# Altium schematic sheet 8_sata.SchDoc
size A4
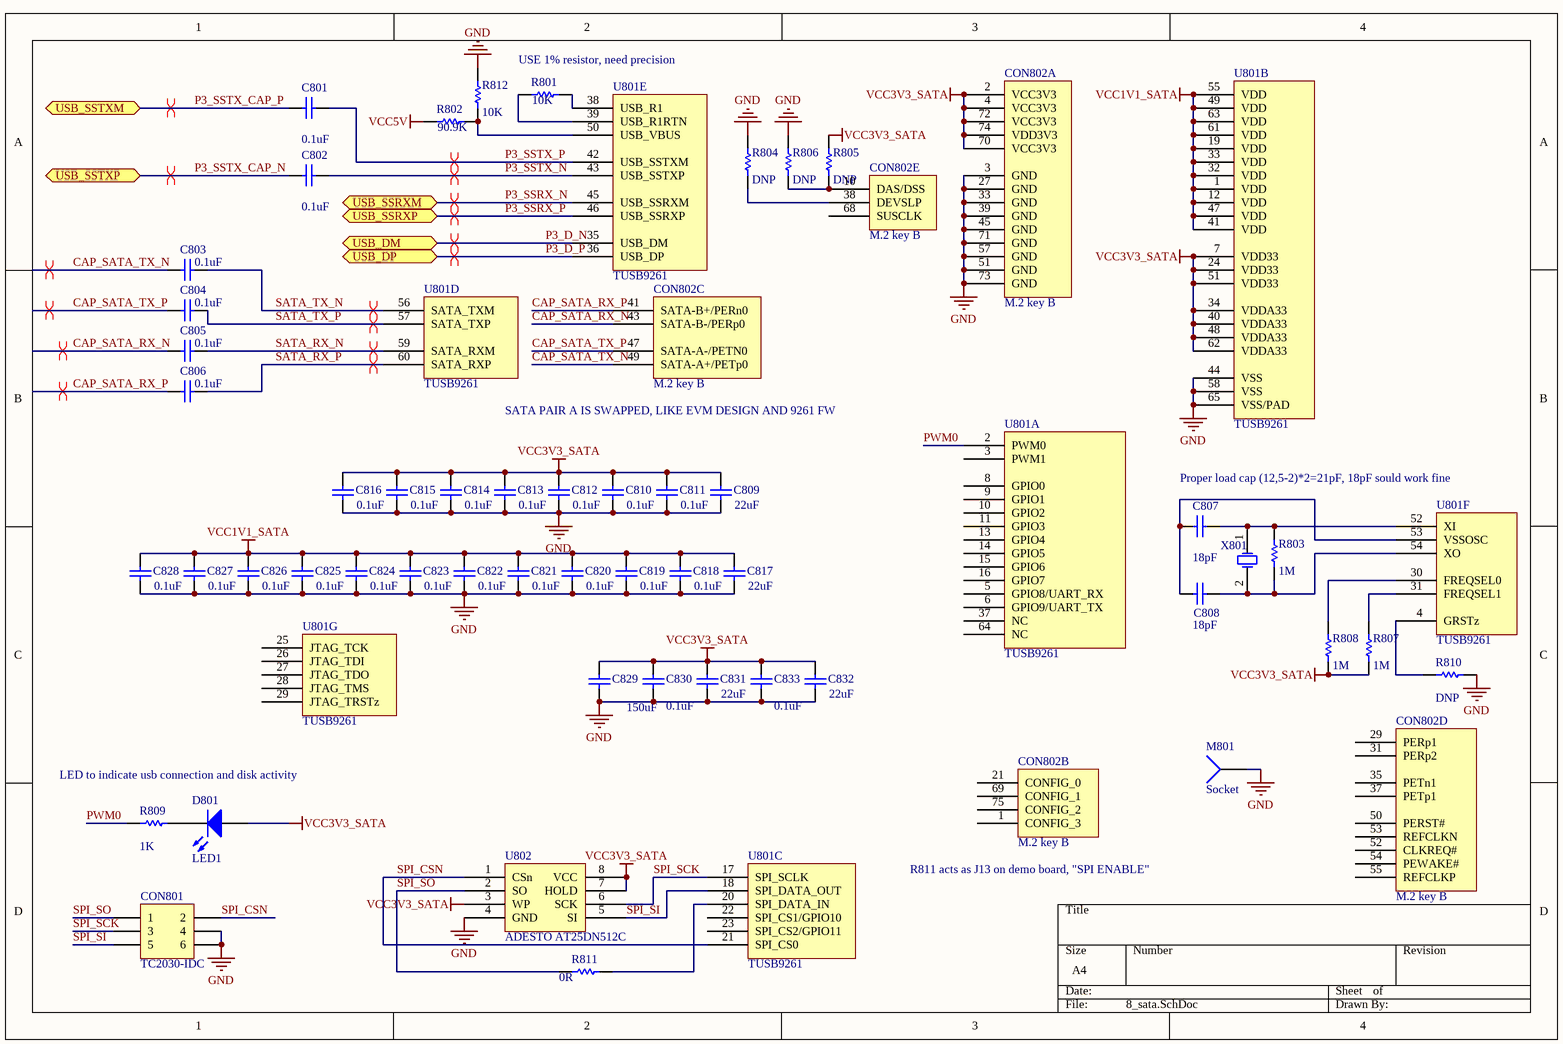
[diagram p0: 8_sata.SchDoc]

## Parts
C801  value 0.1uF  [C0402[1005]]
C802  value 0.1uF  [C0402[1005]]
C803  value 0.1uF  [C0402[1005]]
C804  value 0.1uF  [C0402[1005]]
C805  value 0.1uF  [C0402[1005]]
C806  value 0.1uF  [C0402[1005]]
C807  value 18pF  [C0603[1608]]
C808  value 18pF  [C0603[1608]]
C809  value 22uF  [C1206[3216]]
C810  value 0.1uF  [C0603[1608]]
C811  value 0.1uF  [C0603[1608]]
C812  value 0.1uF  [C0603[1608]]
C813  value 0.1uF  [C0603[1608]]
C814  value 0.1uF  [C0603[1608]]
C815  value 0.1uF  [C0603[1608]]
C816  value 0.1uF  [C0603[1608]]
C817  value 22uF  [C1206[3216]]
C818  value 0.1uF  [C0603[1608]]
C819  value 0.1uF  [C0603[1608]]
C820  value 0.1uF  [C0603[1608]]
C821  value 0.1uF  [C0603[1608]]
C822  value 0.1uF  [C0603[1608]]
C823  value 0.1uF  [C0603[1608]]
C824  value 0.1uF  [C0603[1608]]
C825  value 0.1uF  [C0603[1608]]
C826  value 0.1uF  [C0603[1608]]
C827  value 0.1uF  [C0603[1608]]
C828  value 0.1uF  [C0603[1608]]
C829  value 150uF  [C_9G_9H]
C830  value 0.1uF  [C0603[1608]]
C831  value 22uF  [C1206[3216]]
C832  value 22uF  [C1206[3216]]
C833  value 0.1uF  [C0603[1608]]
CON801  TC2030-IDC  [TC2030-IDC-NL]  (no BOM)
CON802  M.2 key B  [Amphenol 10128796]  (parts A,B,C,D,E of 5)
D801  LED1  [LED0603[1608]]
M801  Socket  [Wurth  9774060243R]
R801  value 10K  [R0603[1608]]
R802  value 90.9K  [R0603[1608]]
R803  value 1M  [R0603[1608]]
R804  value DNP  [R0603[1608]]
R805  value DNP  [R0603[1608]]
R806  value DNP  [R0603[1608]]
R807  value 1M  [R0603[1608]]
R808  value 1M  [R0603[1608]]
R809  value 1K  [R0603[1608]]
R810  value DNP  [R0603[1608]]
R811  value 0R  [R0603[1608]]
R812  value 10K  [R0603[1608]]
U801  TUSB9261  [TUSB9261]  (parts A,B,C,D,E,F,G of 7)
U802  ADESTO AT25DN512C  [ADESTO AT25DN512C -TSOP]
X801  (no value)  [CTS 445-series crystal]

## Ports
USB_DM, USB_DP, USB_SSRXM, USB_SSRXP, USB_SSTXM, USB_SSTXP

## Nets
GND: C809.1 C810.1 C811.1 C812.1 C813.1 C814.1 C815.1 C816.1 C817.1 C818.1 C819.1 C820.1 C821.1 C822.1 C823.1 C824.1 C825.1 C826.1 C827.1 C828.1 C829.1 C830.1 C831.1 C832.1 C833.1 CON801.4 CON801.6 CON802.3(GND) CON802.27(GND) CON802.33(GND) CON802.39(GND) CON802.45(GND) CON802.51(GND) CON802.57(GND) CON802.71(GND) CON802.73(GND) M801.1 R804.1 R806.1 R810.2 R812.1 U801.44(VSS) U801.58(VSS) U801.65(VSS/PAD) U802.4(GND)
VCC1V1_SATA: C817.2 C818.2 C819.2 C820.2 C821.2 C822.2 C823.2 C824.2 C825.2 C826.2 C827.2 C828.2 U801.1(VDD) U801.12(VDD) U801.19(VDD) U801.32(VDD) U801.33(VDD) U801.41(VDD) U801.47(VDD) U801.49(VDD) U801.55(VDD) U801.61(VDD) U801.63(VDD)
VCC3V3_SATA: C809.2 C810.2 C811.2 C812.2 C813.2 C814.2 C815.2 C816.2 C829.2 C830.2 C831.2 C832.2 C833.2 CON802.2(VCC3V3) CON802.4(VCC3V3) CON802.70(VCC3V3) CON802.72(VCC3V3) CON802.74(VDD3V3) D801.2(A) R805.1 R807.2 R808.2 U801.7(VDD33) U801.24(VDD33) U801.34(VDDA33) U801.40(VDDA33) U801.48(VDDA33) U801.51(VDD33) U801.62(VDDA33) U802.3(WP) U802.7(HOLD) U802.8(VCC)
VCC5V: R802.1
CAP_SATA_RX_N: C805.2 CON802.43(SATA-B-/PERp0)
CAP_SATA_RX_P: C806.2 CON802.41(SATA-B+/PERn0)
CAP_SATA_TX_N: C803.2 CON802.49(SATA-A+/PETp0)
CAP_SATA_TX_P: C804.2 CON802.47(SATA-A-/PETN0)
P3_D_N: U801.35(USB_DM) ; port USB_DM
P3_D_P: U801.36(USB_DP) ; port USB_DP
P3_SSRX_N: U801.45(USB_SSRXM) ; port USB_SSRXM
P3_SSRX_P: U801.46(USB_SSRXP) ; port USB_SSRXP
P3_SSTX_CAP_N: C802.2 ; port USB_SSTXP
P3_SSTX_CAP_P: C801.2 ; port USB_SSTXM
P3_SSTX_N: C802.1 U801.43(USB_SSTXP)
P3_SSTX_P: C801.1 U801.42(USB_SSTXM)
PWM0: R809.1 U801.2(PWM0)
SATA_RX_N: C805.1 U801.59(SATA_RXM)
SATA_RX_P: C806.1 U801.60(SATA_RXP)
SATA_TX_N: C803.1 U801.56(SATA_TXM)
SATA_TX_P: C804.1 U801.57(SATA_TXP)
SPI_CSN: CON801.2 U801.21(SPI_CS0) U802.1(CSn)
SPI_SCK: CON801.3 U801.17(SPI_SCLK) U802.6(SCK)
SPI_SI: CON801.5 U801.18(SPI_DATA_OUT) U802.5(SI)
SPI_SO: CON801.1 R811.2 U802.2(SO)
NetC807_1: C807.1 C808.1 U801.53(VSSOSC)
NetC807_2: C807.2 R803.1 U801.52(XI) X801.1(OSC1)
NetC808_2: C808.2 R803.2 U801.54(XO) X801.2(OSC2)
NetCON802_10: CON802.10(DAS/DSS) R805.2 R806.2
NetCON802_38: CON802.38(DEVSLP) R804.2
NetD801_1: D801.1(K) R809.2
NetR801_1: R801.1 U801.39(USB_R1RTN)
NetR801_2: R801.2 U801.38(USB_R1)
NetR802_2: R802.2 R812.2 U801.50(USB_VBUS)
NetR807_1: R807.1 U801.31(FREQSEL1)
NetR808_1: R808.1 U801.30(FREQSEL0)
NetR810_1: R810.1 U801.4(GRSTz)
NetR811_1: R811.1 U801.20(SPI_DATA_IN)

Not connected (* = marked no-connect by the designer): CON802 1(CONFIG_3) 21(CONFIG_0) 29(PERp1) 31(PERp2) 35(PETn1) 37(PETp1) 50(PERST#) 52(CLKREQ#) 53(REFCLKN) 54(PEWAKE#) 55(REFCLKP) 68(SUSCLK) 69(CONFIG_1) 75(CONFIG_2); U801 3(PWM1) 5(GPIO8/UART_RX) 6(GPIO9/UART_TX) 8(GPIO0) 9(GPIO1) 10(GPIO2) 11(GPIO3) 13(GPIO4) 14(GPIO5) 15(GPIO6) 16(GPIO7) 22(SPI_CS1/GPIO10) 23(SPI_CS2/GPIO11) 25(JTAG_TCK) 26(JTAG_TDI) 27(JTAG_TDO) 28(JTAG_TMS) 29(JTAG_TRSTz) 37(NC) 64(NC)

## Layout directives
differential pair: CAP_SATA_RX_N, CAP_SATA_RX_P, CAP_SATA_TX_N, CAP_SATA_TX_P, P3_D_N, P3_D_P, P3_SSRX_N, P3_SSRX_P, P3_SSTX_CAP_N, P3_SSTX_CAP_P, P3_SSTX_N, P3_SSTX_P, SATA_RX_N, SATA_RX_P, SATA_TX_N, SATA_TX_P

## Notes on the sheet
- USE 1% resistor, need precision
- (near CON802) SATA PAIR A IS SWAPPED, LIKE EVM DESIGN AND 9261 FW
- Proper load cap (12,5-2)*2=21pF, 18pF sould work fine
- LED to indicate usb connection and disk activity
- (near CON802) R811 acts as J13 on demo board, "SPI ENABLE"

## Library data of the parts
C801-C806 = Cap: Capacitor; MFG: KEMET; MFGPN: C0402C104K8PACTU; Version: 0402 imperial
C807 C808 = Cap: Capacitor; MFG: KEMET; MFGPN: C0603C150J5GACTU; Version: 0603 imperial
C809 C817 C831 C832 = Cap: Capacitor; MFG: KEMET; MFGPN: C1206C106K4PACTU; Version: 1206 imperial
C810-C816 C818-C828 C830 C833 = Cap: Capacitor; MFG: KEMET; MFGPN: C0603C104M5RACTU; Version: 0603 imperial
C829 = Cap: Capacitor; MFG: United Chemi-Con; MFGPN: EMVA100ADA151MF55G; Version: SMD - 9G or 9H
CON801 = Header 3X2: Header, 3-Pin, Dual row; MFG: No BOM; Value: No BOM; MFGPN: No BOM; Version: No BOM
CON802 = M.2 key B: MFG: Amphenol ICC (FCI); MFGPN: 10128796-001RLF
D801 = LED1: Typical RED GaAs LED; MFGPN: WP934EW/YD; MFG: Kingbright
M801 = Socket: MFG: Würth Elektronik; MFGPN: 9774060243R
R801-R808 R811 = Res1: Resistor; MFG: Vishay Dale; Version: 0603 imperial
R809 R810 = Res1: Resistor; MFG: Vishay Dale; MFGPN: RCA06031K00FKEA; Version: 0603 imperial
R812 = Res1: Resistor; MFG: Vishay Dale; MFGPN: CRCW040222R0FKED; Version: 0603 imperial
U801 = TUSB9261: MFG: Texas Instruments; MFGPN: TUSB9261IPAPRQ1
U802 = ADESTO AT25DN512C: MFGPN: AT25DN512C-XMHF-T; MFG: Adesto Technologies
X801 = XTAL: Crystal Oscillator; MFG: TXC CORPORATION; MFGPN: 7A-40.000MAHE-T